# Altium schematic sheet Sampler_DIOT.SchDoc: =DocumentName
size A3; DocumentNumber: 1; Revision: 0; SheetNumber: 1; SheetTotal: 14; Last modified by: Krzysztof Belewicz
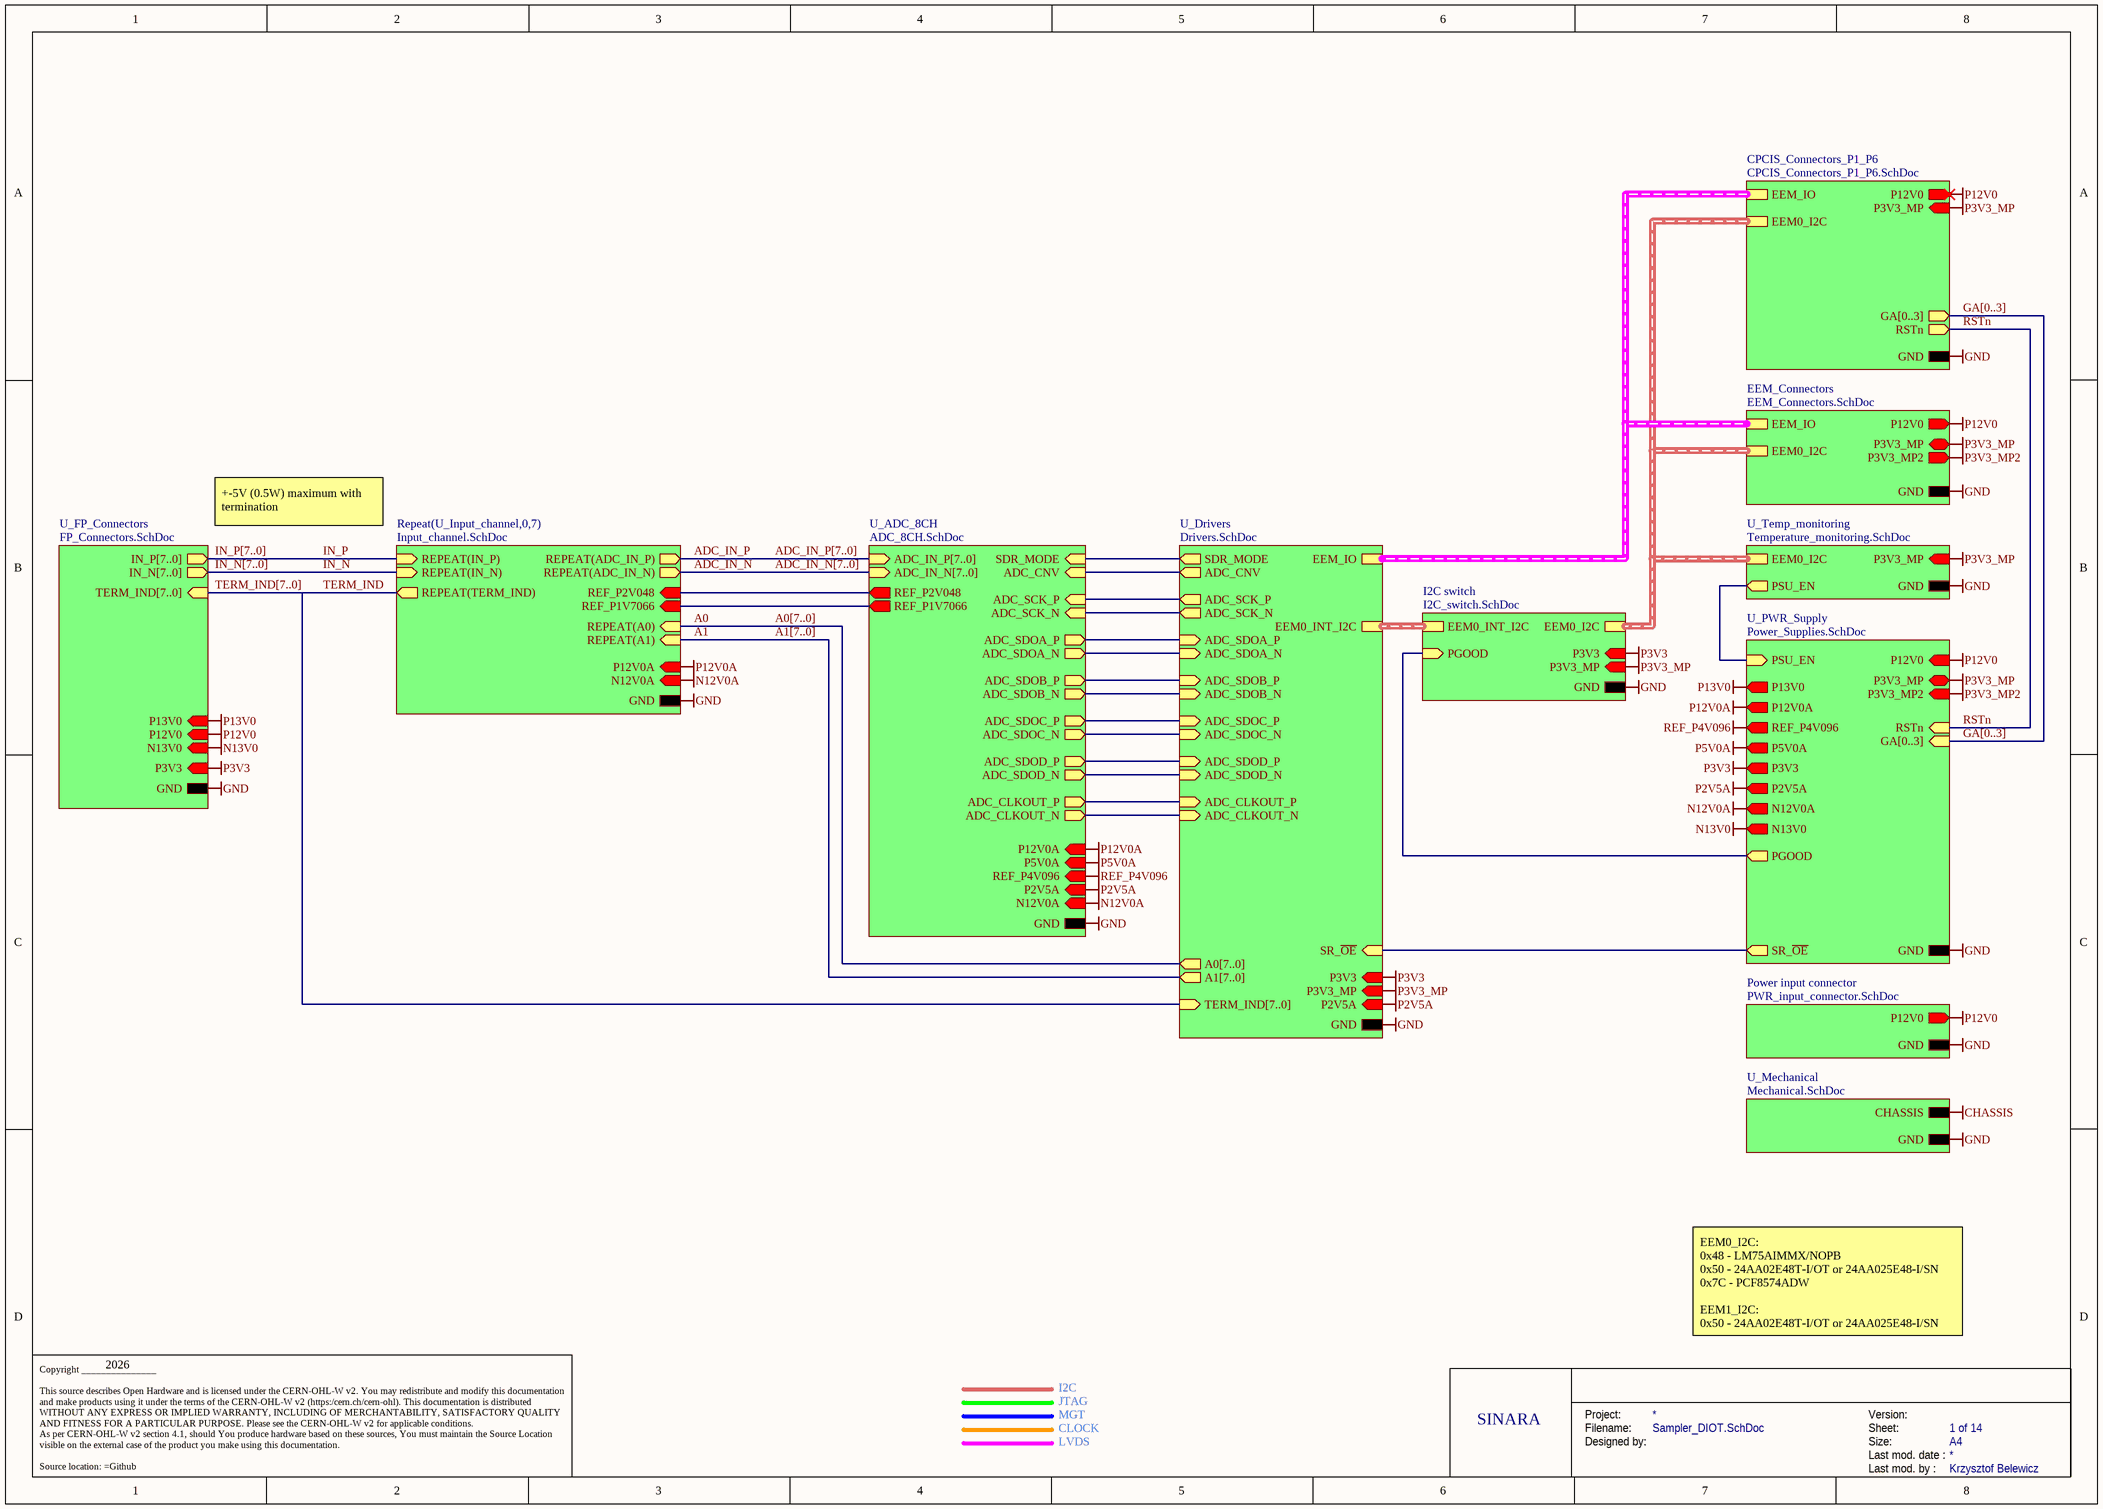
[diagram p0: Sampler_DIOT.SchDoc]

## Sub-sheets
CPCIS_Connectors_P1_P6 = CPCIS_Connectors_P1_P6.SchDoc: P12V0 (out), P3V3_MP (in), EEM_IO (harness EEM_LVDS), EEM0_I2C (harness I2C), GA[0..3] (out), GND, RSTn (out)
EEM_Connectors = EEM_Connectors.SchDoc: P3V3_MP (bidir), P12V0 (out), EEM_IO (harness EEM_LVDS), EEM0_I2C (harness I2C), GND, P3V3_MP2 (out)
I2C switch = I2C_switch.SchDoc: PGOOD (in), EEM0_I2C (harness I2C), EEM0_INT_I2C (harness I2C), GND, P3V3 (in), P3V3_MP (in)
Power input connector = PWR_input_connector.SchDoc: P12V0 (out), GND
Repeat(U_Input_channel,0,7) = Input_channel.SchDoc: REPEAT(IN_N) (in), REPEAT(A0) (in), REPEAT(A1) (in), REPEAT(IN_P) (in), REPEAT(TERM_IND) (out), REPEAT(ADC_IN_N) (out), REPEAT(ADC_IN_P) (out), REF_P2V048 (in), REF_P1V7066 (in), GND, N12V0A (in), P12V0A (in)
U_ADC_8CH = ADC_8CH.SchDoc: ADC_IN_P[7..0] (in), ADC_IN_N[7..0] (in), ADC_SDOA_P (out), ADC_SDOA_N (out), ADC_SCK_P (in), ADC_SCK_N (in), ADC_CNV (in), ADC_SDOB_N (out), ADC_SDOB_P (out), ADC_SDOC_P (out), ADC_SDOC_N (out), ADC_SDOD_N (out), ADC_SDOD_P (out), ADC_CLKOUT_P (out), ADC_CLKOUT_N (out), SDR_MODE (in), REF_P2V048 (out), REF_P1V7066 (out), GND, P2V5A (in), P5V0A (in), REF_P4V096 (in), P12V0A (in), N12V0A (in)
U_Drivers = Drivers.SchDoc: EEM0_INT_I2C (harness I2C), EEM_IO (harness EEM_LVDS), SR_~{OE} (in), A0[7..0] (out), ADC_SCK_P (out), TERM_IND[7..0] (in), ADC_SDOA_N (in), ADC_CLKOUT_N (in), ADC_SCK_N (out), ADC_SDOA_P (in), A1[7..0] (out), ADC_SDOB_P (in), ADC_SDOD_N (in), ADC_CNV (out), ADC_SDOD_P (in), ADC_SDOC_P (in), ADC_SDOC_N (in), ADC_SDOB_N (in), ADC_CLKOUT_P (in), SDR_MODE (out), GND, P3V3 (in), P2V5A (in), P3V3_MP (in)
U_FP_Connectors = FP_Connectors.SchDoc: GND, P3V3 (in), IN_P[7..0] (out), IN_N[7..0] (out), TERM_IND[7..0] (in), N13V0 (in), P12V0 (in), P13V0 (in)
U_Mechanical = Mechanical.SchDoc: CHASSIS, GND
U_PWR_Supply = Power_Supplies.SchDoc: GND, P12V0 (in), P3V3_MP (bidir), PGOOD (out), GA[0..3] (in), RSTn (in), PSU_EN (in), P3V3_MP2 (in), SR_~{OE} (out), P13V0 (out), P12V0A (out), REF_P4V096 (out), P5V0A (out), P3V3 (out), P2V5A (out), N12V0A (out), N13V0 (out)
U_Temp_monitoring = Temperature_monitoring.SchDoc: GND, P3V3_MP (in), EEM0_I2C (harness I2C), PSU_EN (out)

## Nets
CHASSIS: sheet U_Mechanical/CHASSIS
GND: sheet U_PWR_Supply/GND, sheet CPCIS_Connectors_P1_P6/GND, sheet EEM_Connectors/GND, sheet U_Temp_monitoring/GND, sheet U_Mechanical/GND, sheet U_FP_Connectors/GND, sheet U_ADC_8CH/GND, sheet Repeat(U_Input_channel,0,7)/GND, sheet U_Drivers/GND, sheet I2C switch/GND, sheet Power input connector/GND
N12V0A: sheet U_PWR_Supply/N12V0A, sheet U_ADC_8CH/N12V0A, sheet Repeat(U_Input_channel,0,7)/N12V0A
N13V0: sheet U_PWR_Supply/N13V0, sheet U_FP_Connectors/N13V0
P2V5A: sheet U_PWR_Supply/P2V5A, sheet U_ADC_8CH/P2V5A, sheet U_Drivers/P2V5A
P3V3: sheet U_PWR_Supply/P3V3, sheet U_FP_Connectors/P3V3, sheet U_Drivers/P3V3, sheet I2C switch/P3V3
P3V3_MP: sheet U_PWR_Supply/P3V3_MP, sheet CPCIS_Connectors_P1_P6/P3V3_MP, sheet EEM_Connectors/P3V3_MP, sheet U_Temp_monitoring/P3V3_MP, sheet U_Drivers/P3V3_MP, sheet I2C switch/P3V3_MP
P3V3_MP2: sheet U_PWR_Supply/P3V3_MP2, sheet EEM_Connectors/P3V3_MP2
P5V0A: sheet U_PWR_Supply/P5V0A, sheet U_ADC_8CH/P5V0A
P12V0: sheet U_PWR_Supply/P12V0, sheet CPCIS_Connectors_P1_P6/P12V0, sheet EEM_Connectors/P12V0, sheet U_FP_Connectors/P12V0, sheet Power input connector/P12V0
P12V0A: sheet U_PWR_Supply/P12V0A, sheet U_ADC_8CH/P12V0A, sheet Repeat(U_Input_channel,0,7)/P12V0A
P13V0: sheet U_PWR_Supply/P13V0, sheet U_FP_Connectors/P13V0
REF_P4V096: sheet U_PWR_Supply/REF_P4V096, sheet U_ADC_8CH/REF_P4V096
A0: sheet Repeat(U_Input_channel,0,7)/REPEAT(A0)
A1: sheet Repeat(U_Input_channel,0,7)/REPEAT(A1)
ADC_IN_N: sheet Repeat(U_Input_channel,0,7)/REPEAT(ADC_IN_N)
ADC_IN_P: sheet Repeat(U_Input_channel,0,7)/REPEAT(ADC_IN_P)
IN_N: sheet Repeat(U_Input_channel,0,7)/REPEAT(IN_N)
IN_P: sheet Repeat(U_Input_channel,0,7)/REPEAT(IN_P)
RSTn: sheet U_PWR_Supply/RSTn, sheet CPCIS_Connectors_P1_P6/RSTn
TERM_IND: sheet Repeat(U_Input_channel,0,7)/REPEAT(TERM_IND)
(unnamed): sheet U_PWR_Supply/PGOOD, sheet I2C switch/PGOOD
(unnamed): sheet U_PWR_Supply/PSU_EN, sheet U_Temp_monitoring/PSU_EN
(unnamed): sheet U_PWR_Supply/SR_~{OE}, sheet U_Drivers/SR_~{OE}
(unnamed): sheet U_ADC_8CH/ADC_SDOA_P, sheet U_Drivers/ADC_SDOA_P
(unnamed): sheet U_ADC_8CH/ADC_SDOA_N, sheet U_Drivers/ADC_SDOA_N
(unnamed): sheet U_ADC_8CH/ADC_SCK_P, sheet U_Drivers/ADC_SCK_P
(unnamed): sheet U_ADC_8CH/ADC_SCK_N, sheet U_Drivers/ADC_SCK_N
(unnamed): sheet U_ADC_8CH/ADC_CNV, sheet U_Drivers/ADC_CNV
(unnamed): sheet U_ADC_8CH/ADC_SDOB_N, sheet U_Drivers/ADC_SDOB_N
(unnamed): sheet U_ADC_8CH/ADC_SDOB_P, sheet U_Drivers/ADC_SDOB_P
(unnamed): sheet U_ADC_8CH/ADC_SDOC_P, sheet U_Drivers/ADC_SDOC_P
(unnamed): sheet U_ADC_8CH/ADC_SDOC_N, sheet U_Drivers/ADC_SDOC_N
(unnamed): sheet U_ADC_8CH/ADC_SDOD_N, sheet U_Drivers/ADC_SDOD_N
(unnamed): sheet U_ADC_8CH/ADC_SDOD_P, sheet U_Drivers/ADC_SDOD_P
(unnamed): sheet U_ADC_8CH/ADC_CLKOUT_P, sheet U_Drivers/ADC_CLKOUT_P
(unnamed): sheet U_ADC_8CH/ADC_CLKOUT_N, sheet U_Drivers/ADC_CLKOUT_N
(unnamed): sheet U_ADC_8CH/SDR_MODE, sheet U_Drivers/SDR_MODE
(unnamed): sheet U_ADC_8CH/REF_P2V048, sheet Repeat(U_Input_channel,0,7)/REF_P2V048
(unnamed): sheet U_ADC_8CH/REF_P1V7066, sheet Repeat(U_Input_channel,0,7)/REF_P1V7066

## Buses and harness runs
bus A0[7..0] = sheet U_Drivers/A0[7..0]
bus A1[7..0] = sheet U_Drivers/A1[7..0]
bus ADC_IN_N[7..0] = sheet U_ADC_8CH/ADC_IN_N[7..0]
bus ADC_IN_P[7..0] = sheet U_ADC_8CH/ADC_IN_P[7..0]
bus GA[0..3] = sheet CPCIS_Connectors_P1_P6/GA[0..3] = sheet U_PWR_Supply/GA[0..3]
bus IN_N[7..0] = sheet U_FP_Connectors/IN_N[7..0]
bus IN_P[7..0] = sheet U_FP_Connectors/IN_P[7..0]
bus TERM_IND[7..0] = sheet U_Drivers/TERM_IND[7..0] = sheet U_FP_Connectors/TERM_IND[7..0]
harness sheet CPCIS_Connectors_P1_P6/EEM0_I2C = sheet EEM_Connectors/EEM0_I2C = sheet I2C switch/EEM0_I2C = sheet U_Temp_monitoring/EEM0_I2C
harness sheet CPCIS_Connectors_P1_P6/EEM_IO = sheet EEM_Connectors/EEM_IO = sheet U_Drivers/EEM_IO
harness sheet I2C switch/EEM0_INT_I2C = sheet U_Drivers/EEM0_INT_I2C

## Notes on the sheet
- +-5V (0.5W) maximum with termination
- 2026
- I2C
- EEM0_I2C:
  0x48 - LM75AIMMX/NOPB
  0x50 - 24AA02E48T-I/OT or 24AA025E48-I/SN
  0x7C - PCF8574ADW
  EEM1_I2C:
  0x50 - 24AA02E48T-I/OT or 24AA025E48-I/SN
- JTAG
- MGT
- CLOCK
- LVDS
- SINARA
- Project:
- Designed by:
- Filename:
- Size:
- Version:
- Last mod. date :
- Sheet:
- A4
- Copyright _______________
  This source describes Open Hardware and is licensed under the CERN-OHL-W v2. You may redistribute and modify this documentation and make products using it under the terms of the CERN-OHL-W v2 (https:/cern.ch/cern-ohl). This documentation is distributed WITHOUT ANY EXPRESS OR IMPLIED WARRANTY, INCLUDING OF MERCHANTABILITY, SATISFACTORY QUALITY AND FITNESS FOR A PARTICULAR PURPOSE. Please see the CERN-OHL-W v2 for applicable conditions.
  As per CERN-OHL-W v2 section 4.1, should You produce hardware based on these sources, You must maintain the Source Location visible on the external case of the product you make using this documentation.
  Source location: =Github
- Last mod. by :